# Altium schematic sheet 船驱动板.SchDoc
size A3; Organization: Altium Limited; Address1: L3, 12a Rodborough Rd; Address2: Frenchs Forest; Address3: NSW; Address4: Australia 2086
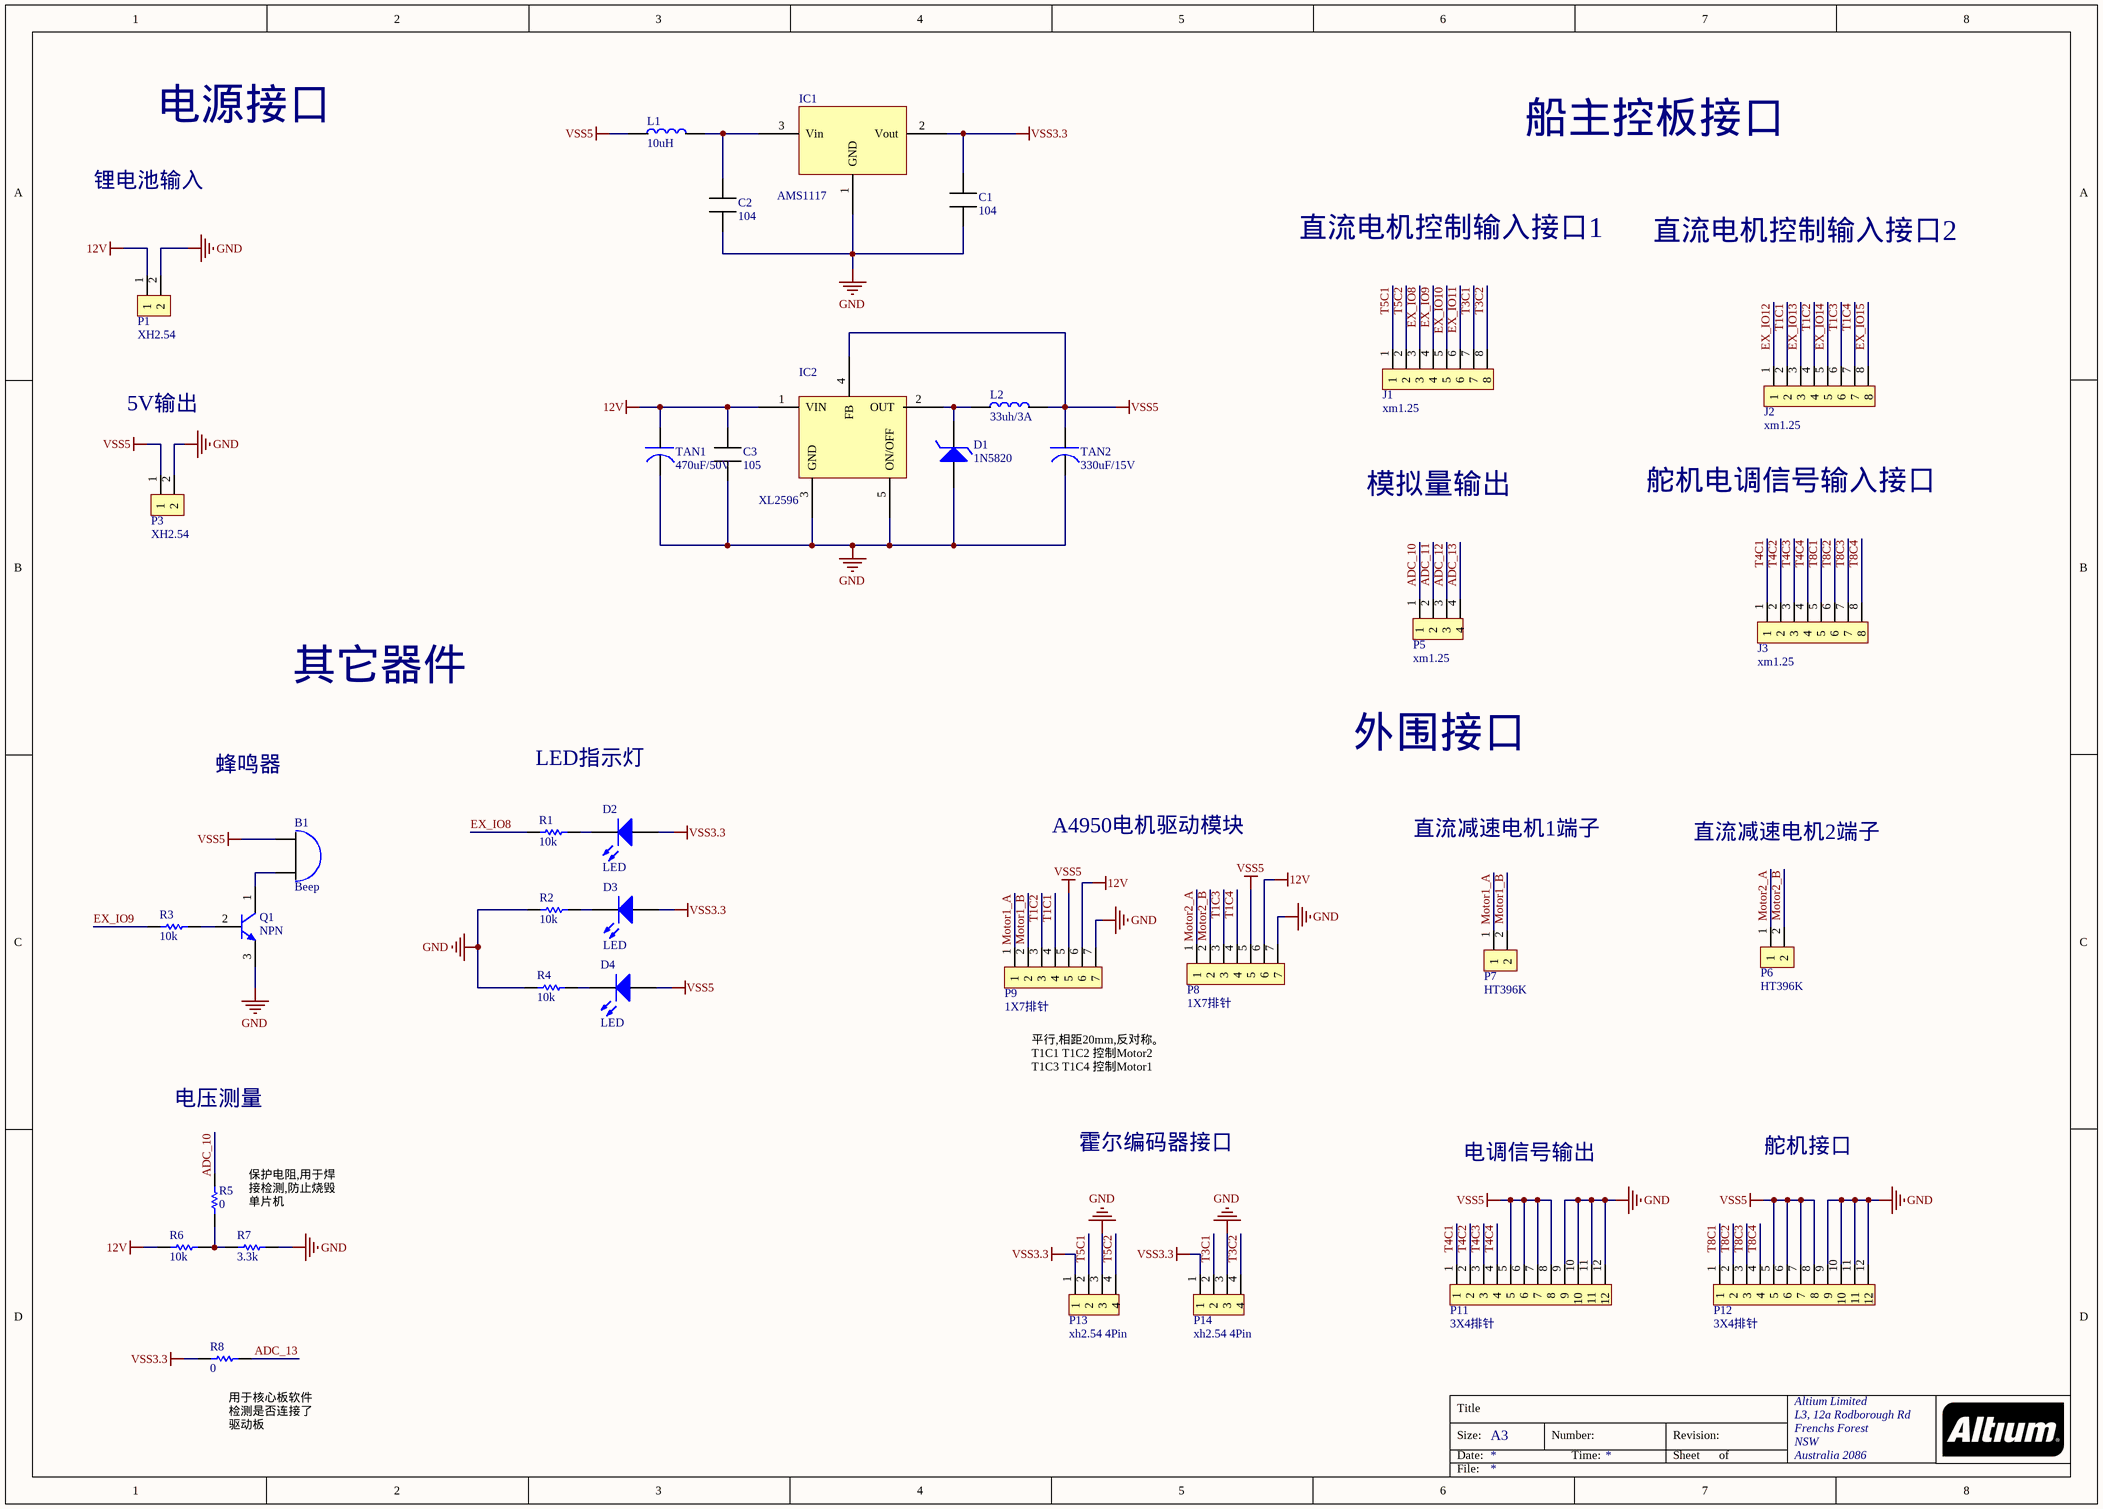
[diagram p0: 船驱动板.SchDoc]

## Parts
B1  Beep  [蜂鸣器]
C1  104  [C 0603]
C2  104  [C 0603]
C3  105  [C 0603]
D1  1N5820  [1N5824]
D2  LED  [LED 0603]
D3  LED  [LED 0603]
D4  LED  [LED 0603]
IC1  AMS1117  [SOT-223]
IC2  XL2596  [TO-263-5]
J1  xm1.25  [MX1.25 8P LS]
J2  xm1.25  [MX1.25 8P LS]
J3  xm1.25  [MX1.25 8P LS]
L1  10uH  [L 0603]
L2  33uh/3A  [CDRH74]
P1  XH2.54  [XH2.54 2P]
P3  XH2.54  [XH2.54 2P]
P5  xm1.25  [MX1.25]
P6  HT396K  [HT396 - 2P]
P7  HT396K  [HT396 - 2P]
P8  1X7排针  [2.54 1X7Pin]
P9  1X7排针  [2.54 1X7Pin]
P11  3X4排针  [2.54 3X4]
P12  3X4排针  [2.54 3X4]
P13  xh2.54 4Pin  [XH2.54 -4p]
P14  xh2.54 4Pin  [XH2.54 -4p]
Q1  NPN  [SOT-23]
R1  10k  [R 0603]
R2  10k  [R 0603]
R3  10k  [R 0603]
R4  10k  [R 0603]
R5  0  [R 0603]
R6  10k  [R 0603]
R7  3.3k  [R 0603]
R8  0  [R 0603]
TAN1  470uF/50V  [10X10.5mm 电解电容]
TAN2  330uF/15V  [8*10.0mm 电解电容]

## Nets
12V: C3.2 IC2.1(VIN) P1.1 P8.6 P9.6 R6.1 TAN1.2
GND: C1.1 C2.1 C3.1 D1.1(A) IC1.1(GND) IC2.3(GND) IC2.5(ON/OFF) P1.2 P3.2 P8.7 P9.7 P11.9 P11.10 P11.11 P11.12 P12.9 P12.10 P12.11 P12.12 P13.3 P14.3 Q1.3(E) R2.1 R4.1 R7.2 TAN1.1 TAN2.1
VSS3.3: C1.2 D2.1(A) D3.1(A) IC1.2(Vout) P13.1 P14.1 R8.1
VSS5: B1.1 D4.1(A) IC2.4(FB) L1.1 L2.2 P3.1 P8.5 P9.5 P11.5 P11.6 P11.7 P11.8 P12.5 P12.6 P12.7 P12.8 TAN2.2
ADC_10: P5.1 R5.2
ADC_11: P5.2
ADC_12: P5.3
ADC_13: P5.4 R8.2
EX_IO8: J1.3 R1.1
EX_IO9: J1.4 R3.1
EX_IO10: J1.5
EX_IO11: J1.6
EX_IO12: J2.1
EX_IO13: J2.3
EX_IO14: J2.5
EX_IO15: J2.8
Motor1_A: P7.1 P9.1
Motor1_B: P7.2 P9.2
Motor2_A: P6.1 P8.1
Motor2_B: P6.2 P8.2
T1C1: J2.2 P9.4
T1C2: J2.4 P9.3
T1C3: J2.6 P8.3
T1C4: J2.7 P8.4
T3C1: J1.7 P14.2
T3C2: J1.8 P14.4
T4C1: J3.1 P11.1
T4C2: J3.2 P11.2
T4C3: J3.3 P11.3
T4C4: J3.4 P11.4
T5C1: J1.1 P13.2
T5C2: J1.2 P13.4
T8C1: J3.5 P12.1
T8C2: J3.6 P12.2
T8C3: J3.7 P12.3
T8C4: J3.8 P12.4
NetB1_2: B1.2 Q1.1(C)
NetC2_2: C2.2 IC1.3(Vin) L1.2
NetD1_2: D1.2(K) IC2.2(OUT) L2.1
NetD2_2: D2.2(K) R1.2
NetD3_2: D3.2(K) R2.2
NetD4_2: D4.2(K) R4.2
NetQ1_2: Q1.2(B) R3.2
NetR5_1: R5.1 R6.2 R7.1

## Notes on the sheet
- 电源接口
- 船主控板接口
- 锂电池输入
- 直流电机控制输入接口1
- 直流电机控制输入接口2
- 5V输出
- 模拟量输出
- 舵机电调信号输入接口
- 其它器件
- 蜂鸣器
- LED指示灯
- 外围接口
- A4950电机驱动模块
- 直流减速电机1端子
- 直流减速电机2端子
- 电压测量
- 平行,相距20mm,反对称。
  T1C1 T1C2 控制Motor2
  T1C3 T1C4 控制Motor1
- 霍尔编码器接口
- 电调信号输出
- 舵机接口
- 保护电阻,用于焊接检测,防止烧毁单片机
- (near R8) 用于核心板软件检测是否连接了驱动板
- Title
- Size:
- Date:
- A3
- Number:
- Time:
- Revision:
- Sheet
- of
- File:

## Library data of the parts
C1-C3 = 电容
D1 = 稳压二极管
D2-D4 = LED: Typical INFRARED GaAs LED; Published: 8-Jun-2000; LatestRevisionDate: 08-Jul-2005; LatestRevisionNote: Mech Layer 1 removed.; PackageReference: LED-0; Publisher: Altium Limited; PackageDescription: LED; 2 Leads
IC1 = AMS1117-3.3
J1-J3 = 1X8排针
L1 L2 = 电感
P1 P3 P6 P7 = 1X2排针
P5 P13 P14 = 1X4排针
P11 P12 = 3X4排针: pin to pad: 1>4 2>3 3>2 4>1
Q1 = NPN: NPN Bipolar Transistor; Published: 8-Jun-2000; LatestRevisionDate: 17-Jul-2002; LatestRevisionNote: Re-released for DXP Platform.; PackageReference: TO-226-AA; Publisher: Altium Limited; PackageDescription: TO, Flat Index; 3 In-Line, Axial Leads; Body Dia. 4.8mm; Leads 0.55 x 0.51 mm (max); Code_JEDEC: TO-226-AA
R1-R8 = Res: Resistor; Published: 8-Jun-2000; LatestRevisionDate: 17-Jul-2002; LatestRevisionNote: Re-released for DXP Platform.; PackageReference: AXIAL-0.3; Publisher: Altium Limited; PackageDescription: Axial Device, Thru-Hole; 2 Leads; 0.3 in Pin Spacing
TAN1 TAN2 = 极性电容